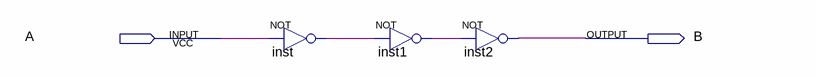
[diagram p0: schematic sheet]
// Quartus schematic AULA1.bdf as structural Verilog: 3 symbols, 2 pins
module AULA1 (
  input  A,
  output B
);

  wire inst1_out, inst_out;

  not inst (inst_out, A);
  not inst1 (inst1_out, inst_out);
  not inst2 (B, inst1_out);
endmodule
